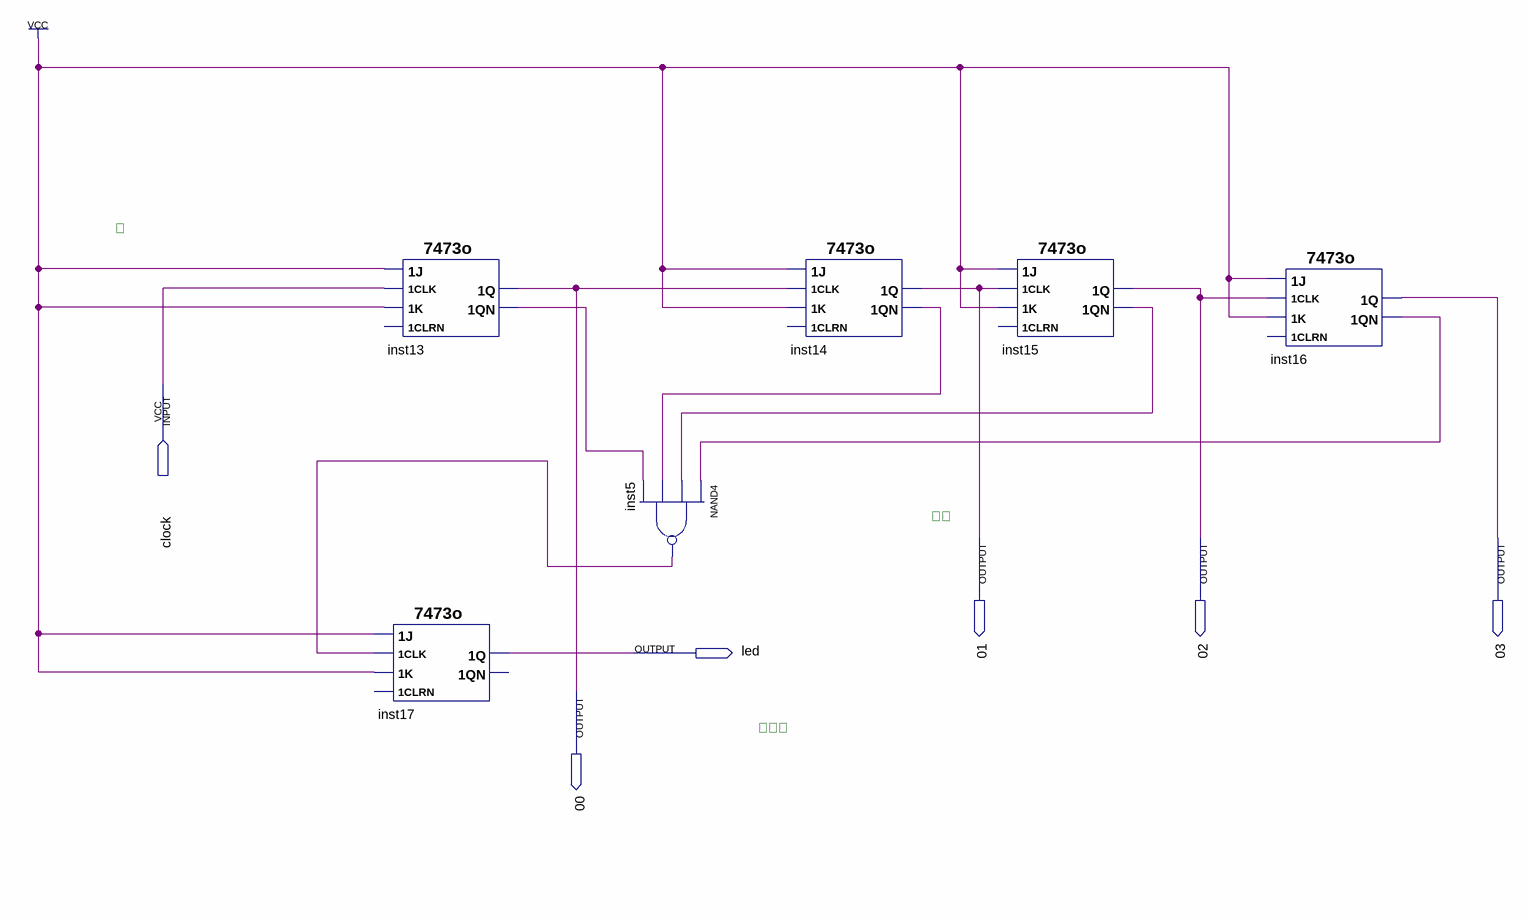
[diagram p0: schematic sheet]
// Quartus schematic lab10.bdf as structural Verilog: 6 symbols, 6 pins
module lab10 (
  input  clock,
  output \01 ,
  output \02 ,
  output \03 ,
  output led,
  output \00 
);

  wire inst5_out, inst13_1qn, inst14_1qn, inst15_1qn, inst16_1qn;

  \7473o  inst13 (.\1J (1'b1), .\1CLK (clock), .\1K (1'b1), .\1QN (inst13_1qn), .\1Q (\00 ));  // open: 1CLRN
  \7473o  inst17 (.\1J (1'b1), .\1CLK (inst5_out), .\1K (1'b1), .\1Q (led));  // open: 1CLRN, 1QN
  nand inst5 (inst5_out, inst16_1qn, inst15_1qn, inst14_1qn, inst13_1qn);
  \7473o  inst14 (.\1J (1'b1), .\1CLK (\00 ), .\1K (1'b1), .\1QN (inst14_1qn), .\1Q (\01 ));  // open: 1CLRN
  \7473o  inst15 (.\1J (1'b1), .\1CLK (\01 ), .\1K (1'b1), .\1QN (inst15_1qn), .\1Q (\02 ));  // open: 1CLRN
  \7473o  inst16 (.\1J (1'b1), .\1CLK (\02 ), .\1K (1'b1), .\1QN (inst16_1qn), .\1Q (\03 ));  // open: 1CLRN
endmodule
